# EAGLE design arduino-shield (EAGLE 7.7.0)

## Sheet 1 of 2
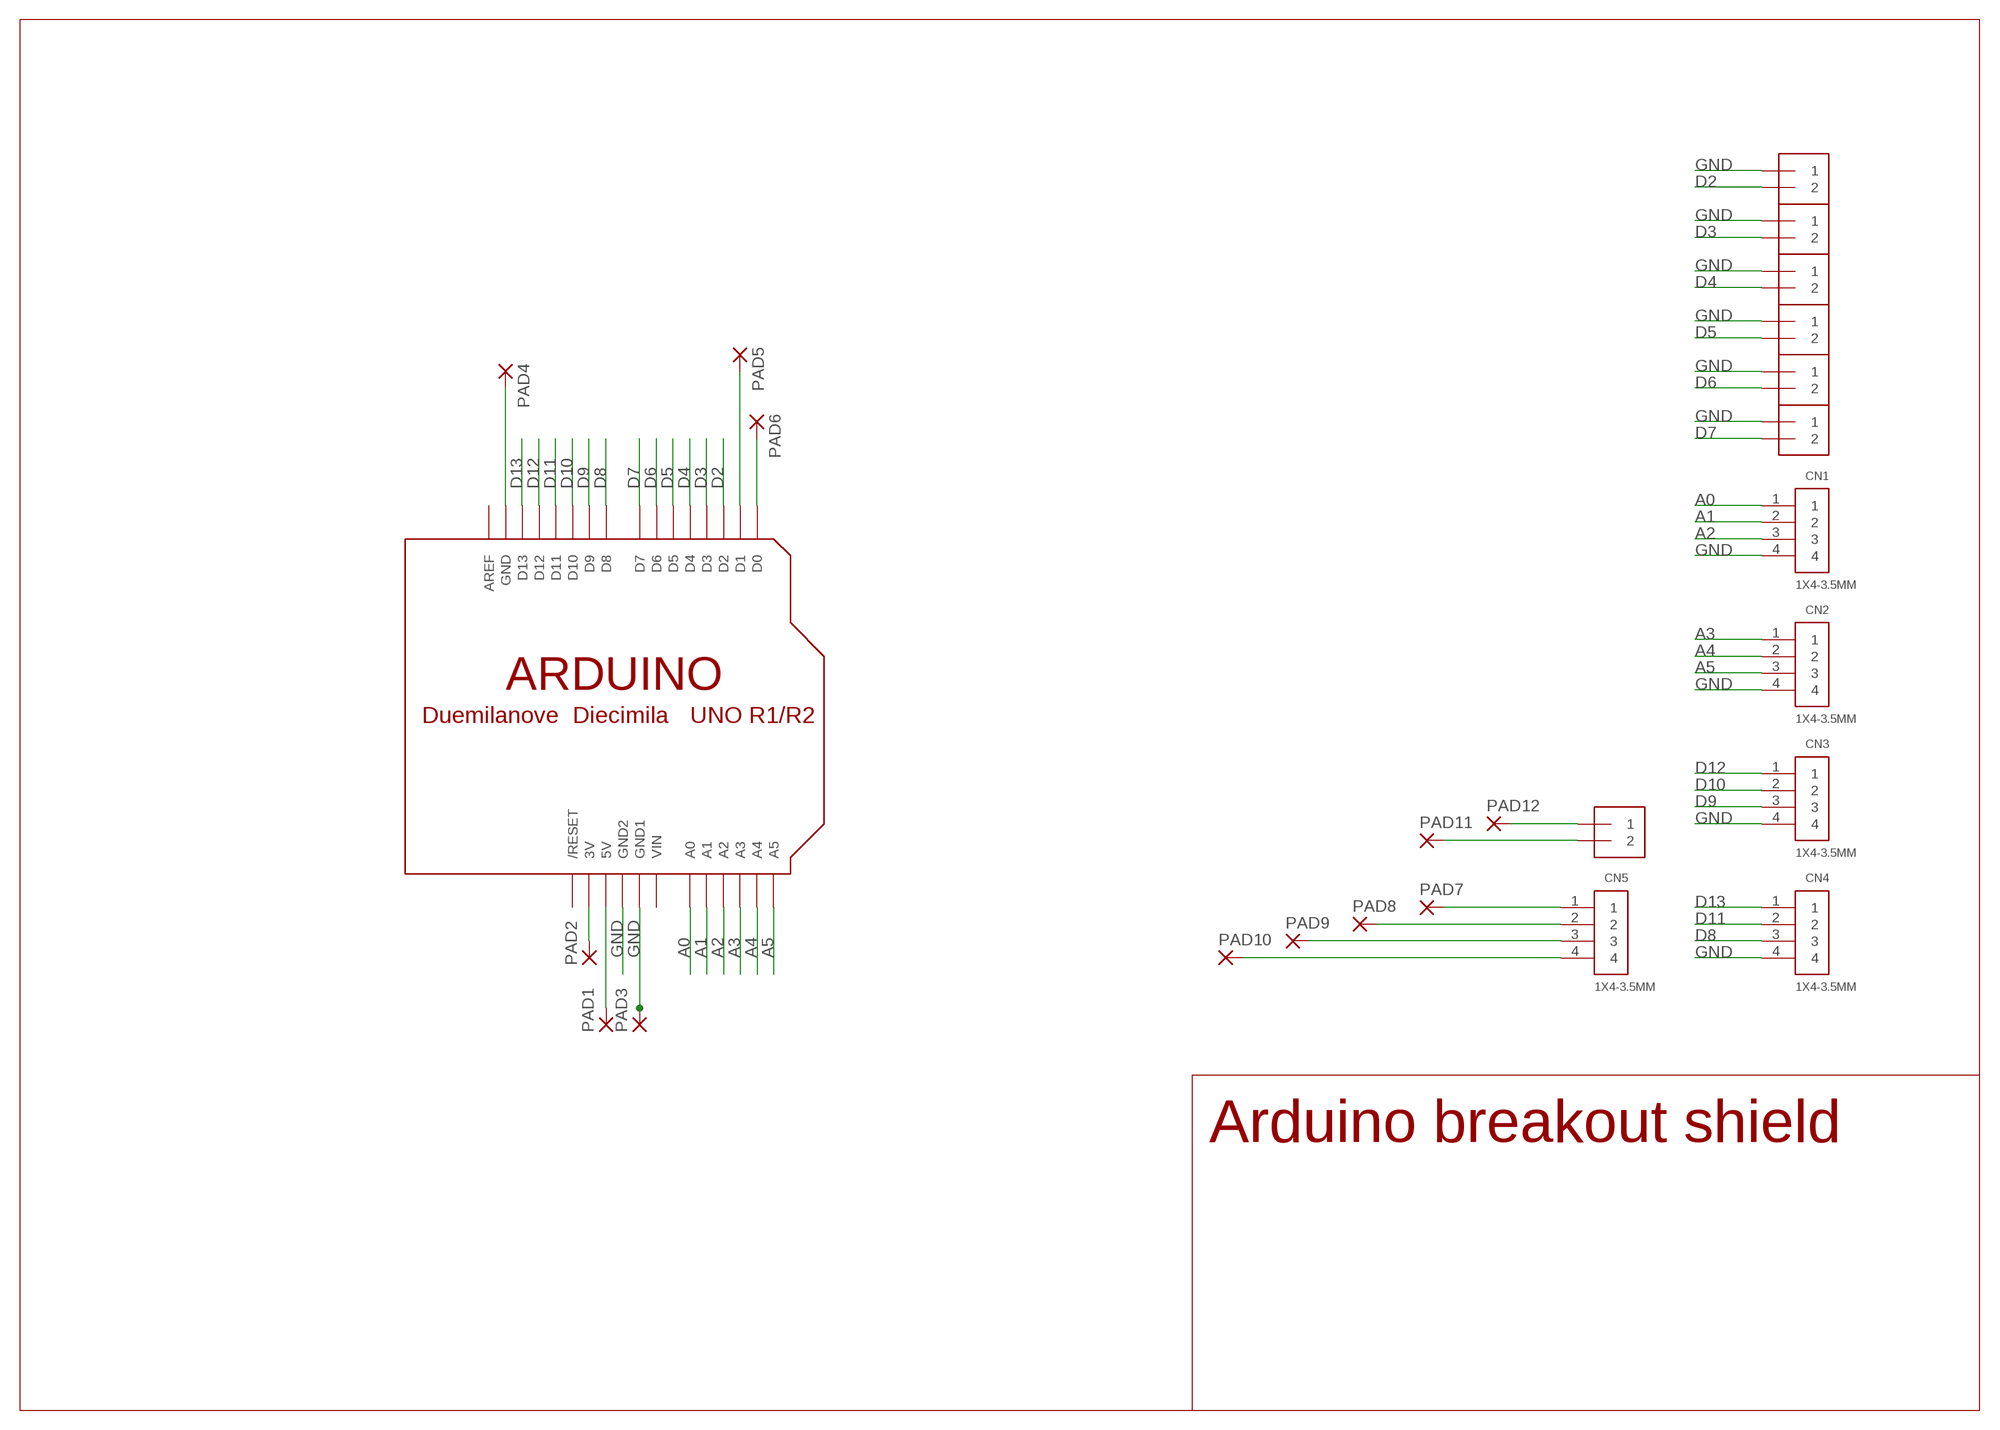
[diagram p0: schematic, sheet 1]

### Parts
CN1  1X4-3.5MM  [1X04-3.5MM]
CN2  1X4-3.5MM  [1X04-3.5MM]
CN3  1X4-3.5MM  [1X04-3.5MM]
CN4  1X4-3.5MM  [1X04-3.5MM]
CN5  1X4-3.5MM  [1X04-3.5MM]
J1  1X2-3.5MM  [1X2-3.5MM]
J2  1X2-3.5MM  [1X2-3.5MM]
J3  1X2-3.5MM  [1X2-3.5MM]
J4  1X2-3.5MM  [1X2-3.5MM]
J5  1X2-3.5MM  [1X2-3.5MM]
J6  1X2-3.5MM  [1X2-3.5MM]
J7  1X2-3.5MM  [1X2-3.5MM]
PAD1  1,6/0,8  [1,6/0,8]
PAD2  1,6/0,8  [1,6/0,8]
PAD3  1,6/0,8  [1,6/0,8]
PAD4  1,6/0,8  [1,6/0,8]
PAD5  1,6/0,8  [1,6/0,8]
PAD6  1,6/0,8  [1,6/0,8]
PAD7  1,6/0,8  [1,6/0,8]
PAD8  1,6/0,8  [1,6/0,8]
PAD9  1,6/0,8  [1,6/0,8]
PAD10  1,6/0,8  [1,6/0,8]
PAD11  1,6/0,8  [1,6/0,8]
PAD12  1,6/0,8  [1,6/0,8]
U$1  ARDUINO-NOHOLE  [ARDUINO-NOHOLE]

### Nets
A0: CN1.1 U$1.A0
A1: CN1.2 U$1.A1
A2: CN1.3 U$1.A2
A3: CN2.1 U$1.A3
A4: CN2.2 U$1.A4
A5: CN2.3 U$1.A5
D2: J1.2 U$1.D2
D3: J2.2 U$1.D3
D4: J3.2 U$1.D4
D5: J4.2 U$1.D5
D6: J5.2 U$1.D6
D7: J6.2 U$1.D7
D8: CN4.3 U$1.D8
D9: CN3.3 U$1.D9
D10: CN3.2 U$1.D10
D11: CN4.2 U$1.D11
D12: CN3.1 U$1.D12
D13: CN4.1 U$1.D13
GND: CN1.4 CN2.4 CN3.4 CN4.4 J1.1 J2.1 J3.1 J4.1 J5.1 J6.1 PAD3.1(P) U$1.GND1 U$1.GND2
N$1: PAD2.1(P) U$1.3V
N$2: PAD1.1(P) U$1.5V
N$3: PAD6.1(P) U$1.D0
N$4: PAD5.1(P) U$1.D1
N$5: PAD4.1(P) U$1.GND
N$6: J7.1 PAD12.1(P)
N$7: J7.2 PAD11.1(P)
N$8: CN5.1 PAD7.1(P)
N$9: CN5.2 PAD8.1(P)
N$10: CN5.3 PAD9.1(P)
N$11: CN5.4 PAD10.1(P)
Unconnected: U$1.AREF U$1.RESET(/RESET)

### Notes on the sheet
- Arduino breakout shield

## Sheet 2 of 2
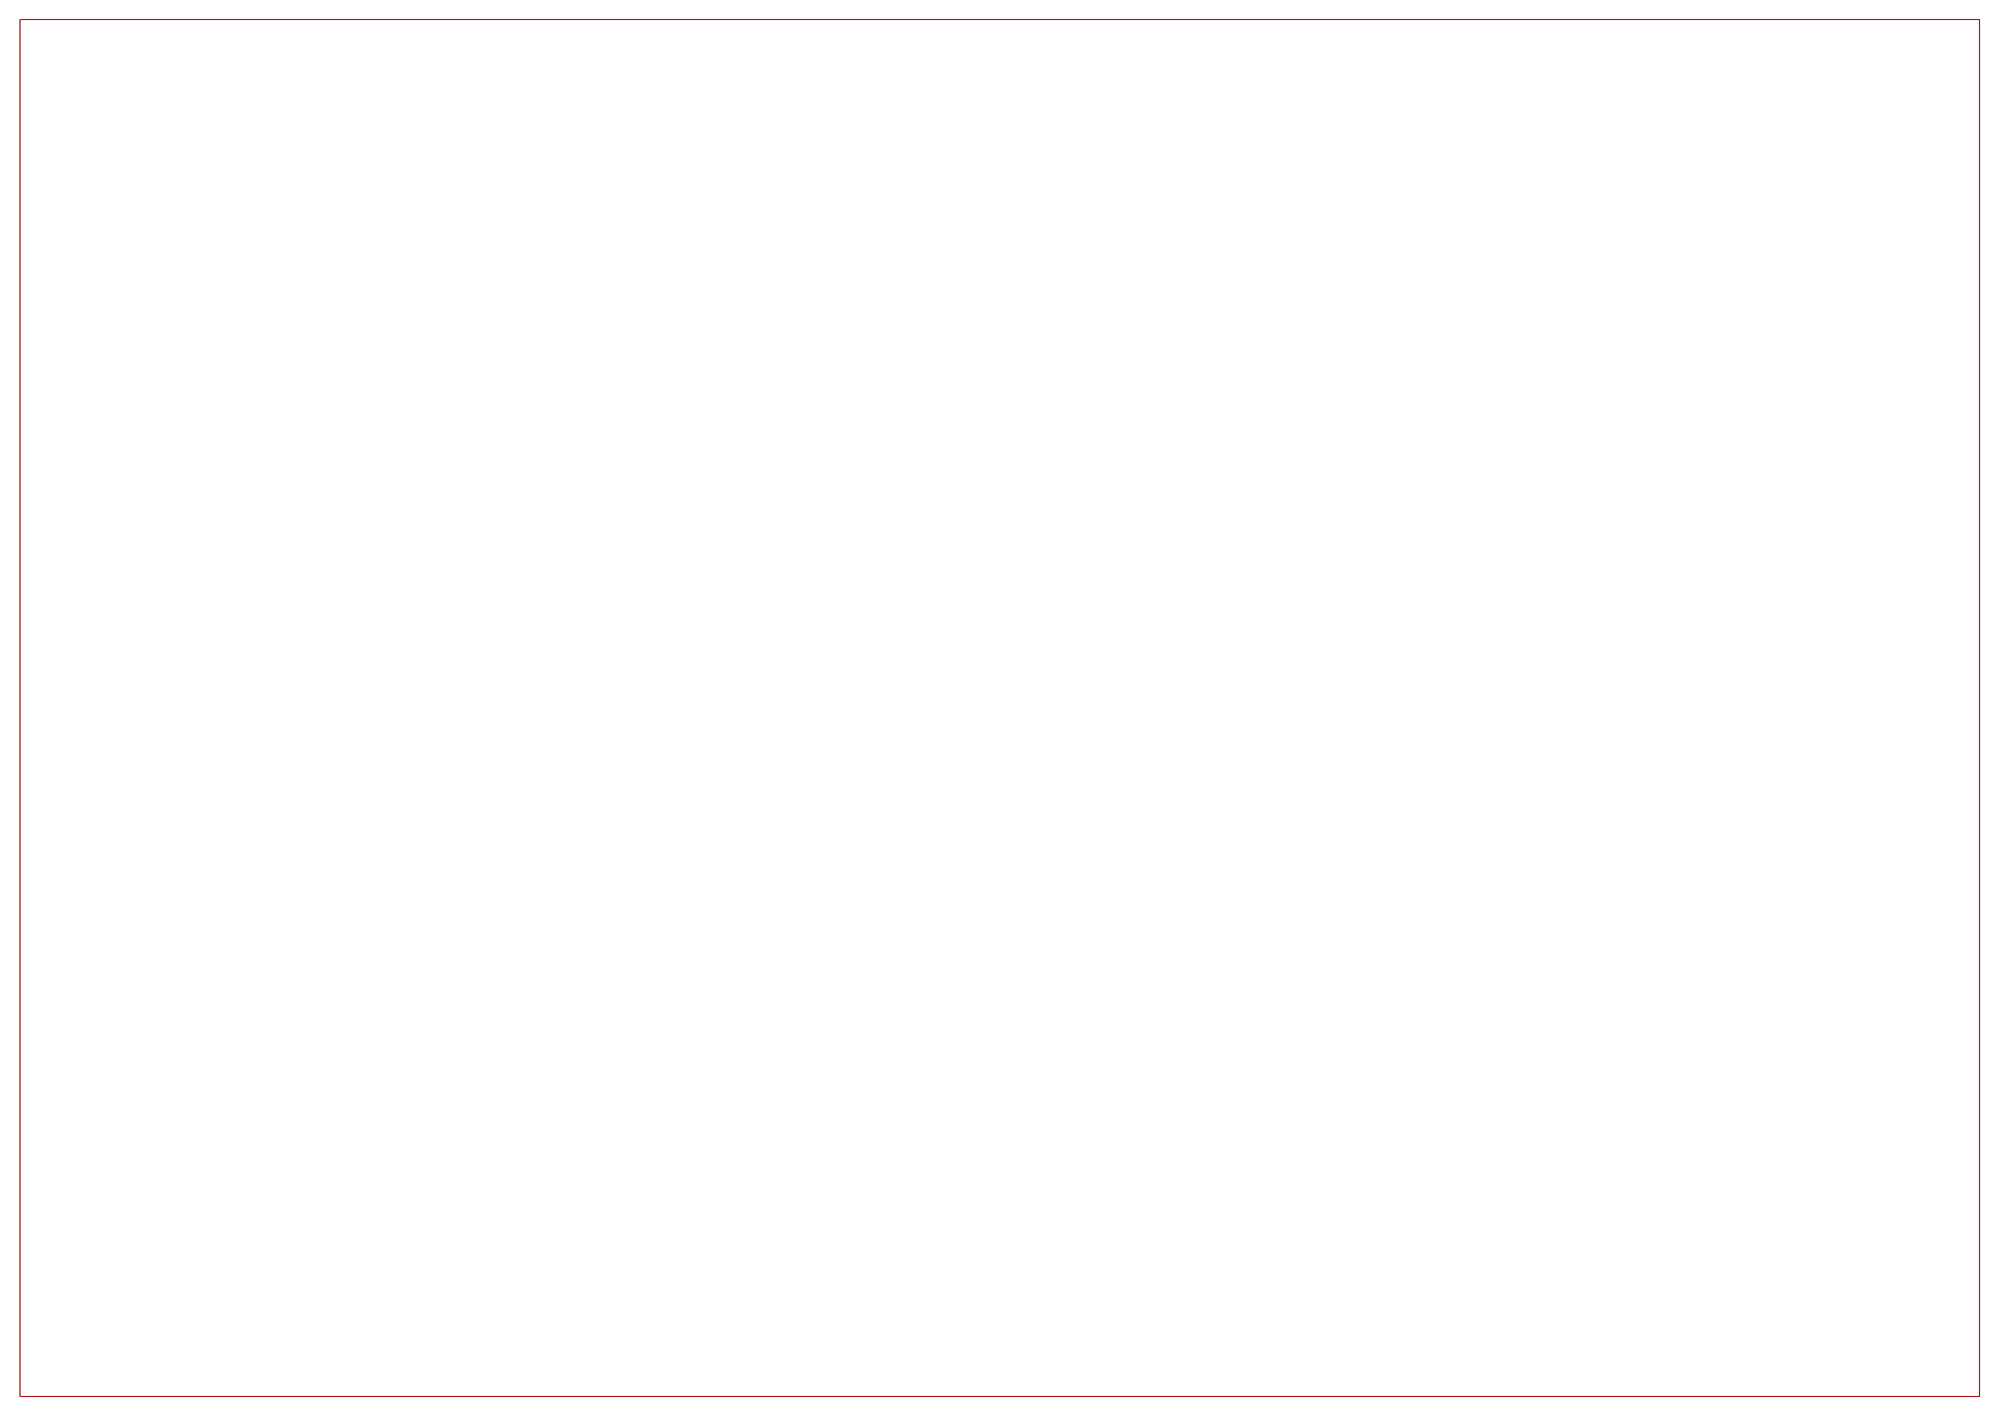
[diagram p1: schematic, sheet 2]

## Power pins joined to a net without a drawn wire
VIN: U$1.VIN

## Library data of the parts
CN1-CN5 = adafruit:1X4: 4-pin connector
J1-J7 = adafruit:1X2: 3.5mm Terminal block http://www.ladyada.net/library/pcb/eaglelibrary.html
PAD1-PAD12 = wirepad:1,6/0,8: THROUGH-HOLE PAD
U$1 = adafruit:ARDUINO: Arduino Diecimila/Duemilanove Make a shield with ease, this package has all the named pins as well as the two mounting drill holes and an outline of the USB and DC power connector. The outline is on the DIMENSION layer, so if your board house uses it they will cut the outline to match. http://www.ladyada.net/library/pcb/eaglelibrary.html

## Board
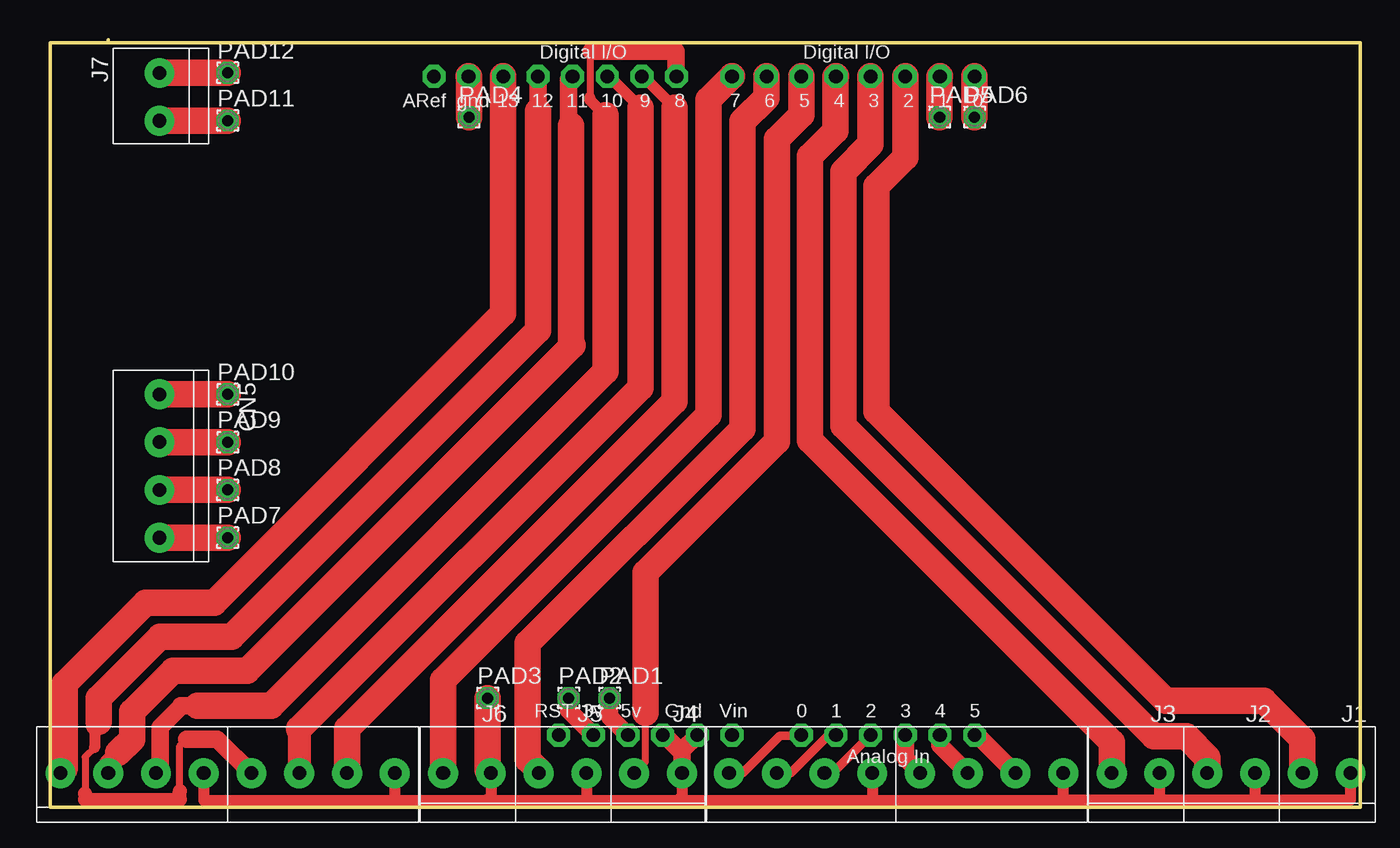
[diagram p2: board, top side]
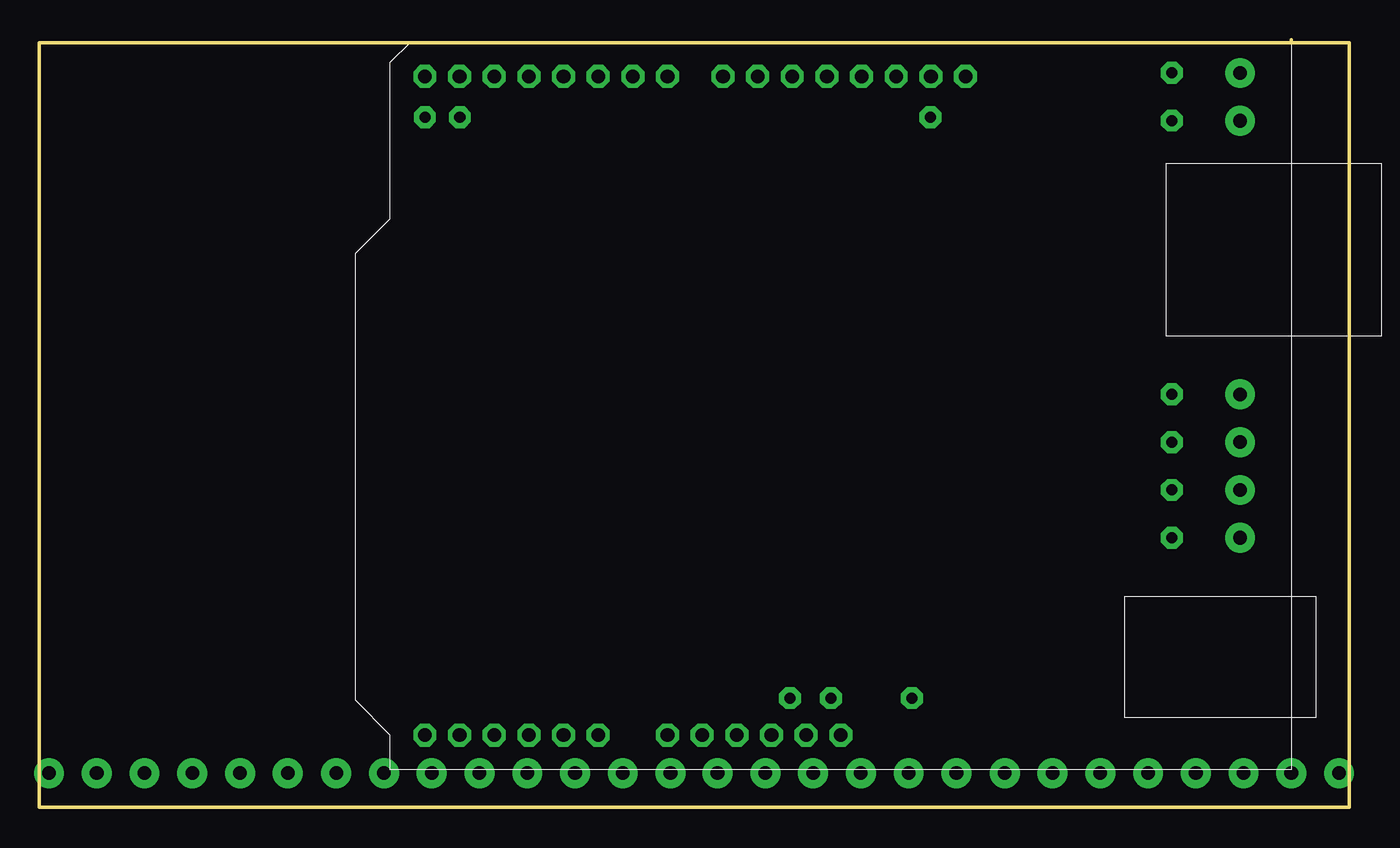
[diagram p3: board, bottom side, seen from below]

No outline drawn. Coordinates in mm, seen from the top.
Copper layers (1*16): Top 0.035mm / dielectric 1.5mm / Bottom 0.035mm
Design rules "default": minimum track width 10mil, minimum drill 24mil, track to track 8mil, track to pad 8mil, pad to pad 8mil, via to via 8mil, smd to smd 8mil, copper to edge 40mil, drill to drill 8mil, minimum pad ring 10mil, minimum via ring 8mil, stop-mask expansion 4mil, vias tented up to drill 0mil, thermal gap 10mil
Milling: 6 lines

### Footprints (pad centres in the part's own frame; a part is rotated, then mirrored left to right if it is on the bottom)
1X04-3.5MM = drill 1 pad 2.184: 1 -5.25,0; 2 -1.75,0; 3 1.75,0; 4 5.25,0
1X2-3.5MM = drill 1 pad 2.184: 1 1.8,0; 2 -1.7,0
1,6/0,8 = drill 0.813 pad 1.6 octagon: 1 0,0
ARDUINO-NOHOLE = drill 1 pad 1.676 octagon: 3V 35.56,2.54; 5V 38.1,2.54; A0 50.8,2.54; A1 53.34,2.54; A2 55.88,2.54; A3 58.42,2.54; A4 60.96,2.54; A5 63.5,2.54; AREF 23.876,50.8; D0 63.5,50.8; D1 60.96,50.8; D2 58.42,50.8; D3 55.88,50.8; D4 53.34,50.8; D5 50.8,50.8; D6 48.26,50.8; D7 45.72,50.8; D8 41.656,50.8; D9 39.116,50.8; D10 36.576,50.8; D11 34.036,50.8; D12 31.496,50.8; D13 28.956,50.8; GND 26.416,50.8; GND1 43.18,2.54; GND2 40.64,2.54; RESET 33.02,2.54; VIN 45.72,2.54

### Placement (x,y rotation side)
CN1  55,2.5 0 top
CN2  69,2.5 0 top
CN3  20,2.5 0 top
CN4  6,2.5 0 top
CN5  8,25 90 top
J1  93.5,2.5 0 top
J2  86.5,2.5 0 top
J3  79.5,2.5 0 top
J4  44.5,2.5 0 top
J5  37.5,2.5 0 top
J6  30.5,2.5 0 top
J7  8,52 90 top
PAD1  41,8 0 top
PAD2  38,8 0 top
PAD3  32.06,8 0 top
PAD4  30.69,50.56 0 top
PAD5  65.19,50.56 0 top
PAD6  67.75,50.56 0 top
PAD7  13,19.75 0 top
PAD8  13,23.25 0 top
PAD9  13,26.75 0 top
PAD10  13,30.25 0 top
PAD11  13,50.31 0 top
PAD12  13,53.81 0 top
U$1  4.25,2.75 0 top

### Tracks (layer width: path | path; a pad name or v marks a point on that pad's centre or on a via)
A0
  Top 0.61: CN1.1 50.75,2.5 53.5,5.25 55.01,5.25 U$1.A0
A1
  Top 0.61: U$1.A1 57.04,5.29 54.25,2.5 CN1.2
A2
  Top 0.61: CN1.3 57.34,2.5 U$1.A2
A3
  Top 1.27: U$1.A3 62.67,3.58 CN2.1
A4
  Top 1.27: U$1.A4 65.21,4.54 CN2.2
A5
  Top 1.27: U$1.A5 67.96,5.29 CN2.3
D2
  Top 1.93: U$1.D2 62.67,47.61 60.56,45.5 60.56,29 81.75,7.81 88.94,7.81 91.75,5 91.75,2.55 J1.2
D3
  Top 1.93: U$1.D3 60.13,48.57 58.12,46.56 58.12,27.94 80.88,5.19 83.25,5.19 84.81,3.62 84.81,2.51 J2.2
D4
  Top 1.93: U$1.D4 57.56,53.52 57.56,49.56 55.69,47.69 55.69,26.88 77.8,4.76 J3.2
D5
  Top 0.5: J4.2 43.62,3.33 43.62,6.94
  Top 1.93: 43.62,6.94 43.62,17.19 53.25,26.81 53.25,48.94 55.05,50.74 U$1.D5
D6
  Top 1.93: J5.2 35.8,2.7 35,3.5 35,12 50.75,27.75 50.75,50.25 52.5,52 U$1.D6
D7
  Top 1.93: J6.2 28.8,9.3 48.25,28.75 48.25,51.83 U$1.D7
D8
  Top 0.5: 39.62,55.38 39.56,55.31 39.56,52
  Top 0.813: 39.56,52 39.56,51.81 40.69,50.69
  Top 1.27: U$1.D8 45.88,53.58 45.88,55.38 39.62,55.38 | CN4.3 8.06,2.81 8.06,5.88 9.56,7.38 9.56,7.44 10.81,7.44
  Top 1.93: 40.69,50.69 40.69,31.94 16.19,7.44 10.81,7.44
D9
  Top 0.813: U$1.D9 43.45,53.55 45.75,51.25
  Top 1.93: 45.75,51.25 45.75,29.75 21.75,5.75 CN3.3
D10
  Top 0.813: U$1.D10 40.95,53.55 43.25,51.25
  Top 1.676: 18.25,5.75 CN3.2
  Top 1.93: 43.25,51.25 43.25,30.75 18.25,5.75
D11
  Top 1.27: 5,4 4.25,3.25 CN4.2 | 38,53.26 U$1.D11 arc90 38,53.26 | 38.19,49.94 arc-90 38,50.12 38,53.26
  Top 1.93: 5,4 6,5 6,7 9,10 14.44,10 38.29,33.85 arc-90 38.19,33.95 38.19,49.94
D12
  Top 0.5: 3.25,4.38 2.56,3.69 2.56,1 | 9.5,1.19 9.5,4.5 10,5
  Top 0.813: 3.25,5.94 3.25,4.38
  Top 1.016: 2.56,1 2.56,0.56 9.5,0.56 9.5,1.19
  Top 1.27: 35.75,51 U$1.D12 | 3.56,6.25 3.25,5.94 | 10,5 12.25,5 CN3.1
  Top 1.93: 35.75,51 35.75,34.93 13.31,12.5 8.06,12.5 3.56,8 3.56,6.25
D13
  Top 1.93: U$1.D13 33.21,36.21 12,15 7,15 1.06,9.06 1.06,2.88 0.75,2.56 CN4.1 1,2.75
GND
  Top 0.813: CN4.4 11.25,0.5 25,0.5 | 25,0.5 32,0.5 | 32,0.5 39.5,0.5 | 39.5,0.5 46,0.5 | 46,0.5 60,0.5 | 60,0.5 74.25,0.5 | 74.25,0.5 CN2.4 | CN1.4 60.25,0.75 60,0.5 | CN3.4 25.25,0.75 25,0.5 | J6.1 32.3,0.8 32,0.5 | J5.1 39.3,0.7 39.5,0.5 | J4.1 46.3,0.8 46,0.5 | J1.1 95.3,0.55 95.25,0.5 88.5,0.5 | 88.5,0.5 81.25,0.5 | 81.25,0.5 74.25,0.5 | J3.1 81.3,0.55 81.25,0.5 | J2.1 88.3,0.7 88.5,0.5
  Top 1.27: J4.1 46.3,4 | 46.3,4 46.3,4.16 U$1.GND1 | U$1.GND2 45.01,5.29 46.3,4
  Top 1.93: PAD3.1 32.06,2.74 J6.1
N$1
  Top 1.27: PAD2.1 38,7.1 U$1.3V
N$2
  Top 1.27: PAD1.1 41,6.64 U$1.5V
N$3
  Top 1.93: PAD6.1 U$1.D0
N$4
  Top 1.93: PAD5.1 65.19,53.53 U$1.D1
N$5
  Top 1.93: PAD4.1 30.69,53.53 U$1.GND
N$6
  Top 1.93: J7.1 PAD12.1
N$7
  Top 1.93: J7.2 PAD11.1
N$8
  Top 1.93: CN5.1 PAD7.1
N$9
  Top 1.93: CN5.2 PAD8.1
N$10
  Top 1.93: CN5.3 PAD9.1
N$11
  Top 1.93: CN5.4 PAD10.1